# Altium schematic sheet XTAL_or_OSC.SchDoc
size A3; SheetNumber: 14; SheetTotal: 27
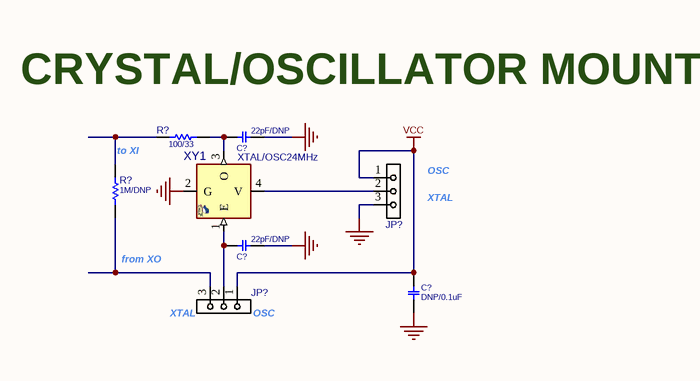
[diagram p0: XTAL_or_OSC.SchDoc]

## Parts
(Parts that share a designator on the sheet are numbered #1, #2 ... from top to bottom, then left to right.)
C?#1  22pF/DNP  [C0402]
C?#2  22pF/DNP  [C0402]
C?#3  DNP/0.1uF  [C0402]
JP?#1  JMPHDR3PIN  [JP_3_60W]  (value not drawn)
JP?#2  JMPHDR3PIN  [JP_3_60W]  (value not drawn)
R?#1  100/33  [R0402]
R?#2  1M/DNP  [R0402]
XY1  XTAL/OSC24MHz  [XTL_4_2016]

## Nets
GND: C?#1.2 C?#2.2 C?#3.1 JP?#1.3 XY1.2(G)
VCC: C?#3.2 JP?#1.1 JP?#2.1
NetC?#1_1: C?#1.1 R?#1.1 XY1.3(O)
NetC?#2_1: C?#2.1 JP?#2.2 XY1.1(E)
NetJP?#1_2: JP?#1.2 XY1.4(V)
NetJP?#2_3: JP?#2.3 R?#2.1
NetR?#1_2: R?#1.2 R?#2.2

## Notes on the sheet
- CRYSTAL/OSCILLATOR MOUNTING
- (near R?#2) to XI
- (near JP?#1) XTAL
- (near JP?#1) OSC
- from XO
- (near JP?#2) XTAL
- (near JP?#2) OSC

## Library data of the parts
C?#1-C?#3 = CAP_SMD_MLCC_100n50TDK: CAP, MLCC; MANF: Murata; PARAM2: 50v; PARAM: -; MANF_P#: -; ASSEMBLY: ASSEMBLY; PRICE: 100: 0.018$
  C?#1 C?#2: VALUE: 22pF/DNP
  C?#3: VALUE: DNP/0.1uF
JP?#1 JP?#2 = JUMPER_SOLDER_3P: JUMPER, HEADER 3PIN; MANF: MANF; MANF_P#: MANF_P#; VALUE: JMPHDR3PIN
R?#1 R?#2 = RES_SMD: RESISTOR, SMD; PARAM: -W; DESC: DESCRIPTION; DIST#: MOUSER; PARAM2: 1%; MANF_P#: -; MANF: -; ASSEMBLY: ASSEMBLY; PRICE: 100= 0.5$
  R?#1: VALUE: 100/33
  R?#2: VALUE: 1M/DNP
XY1 = OSC_4_8MHz_2016K: PARAM: 20PPM, 15pF, -40~85℃; MANF_P#: OT201624MJBA4SL; PARAM2: 1.8/3.3V; MANF: -; PRICE: 0.6$; VALUE: XTAL/OSC24MHz